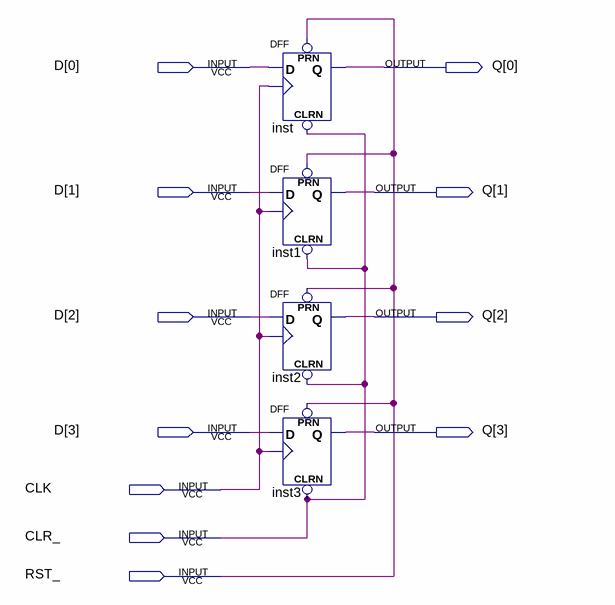
[diagram p0: schematic sheet]
// Quartus schematic Count5to10.bdf as structural Verilog: 4 symbols, 11 pins
module Count5to10 (
  input  [3:0] D,
  input  CLK,
  input  CLR_,
  input  RST_,
  output [3:0] Q
);

  DFF inst (.CLRN(CLR_), .CLK(CLK), .D(D[0]), .PRN(RST_), .Q(Q[0]));
  DFF inst1 (.CLRN(CLR_), .CLK(CLK), .D(D[1]), .PRN(RST_), .Q(Q[1]));
  DFF inst2 (.CLRN(CLR_), .CLK(CLK), .D(D[2]), .PRN(RST_), .Q(Q[2]));
  DFF inst3 (.CLRN(CLR_), .CLK(CLK), .D(D[3]), .PRN(RST_), .Q(Q[3]));
endmodule
